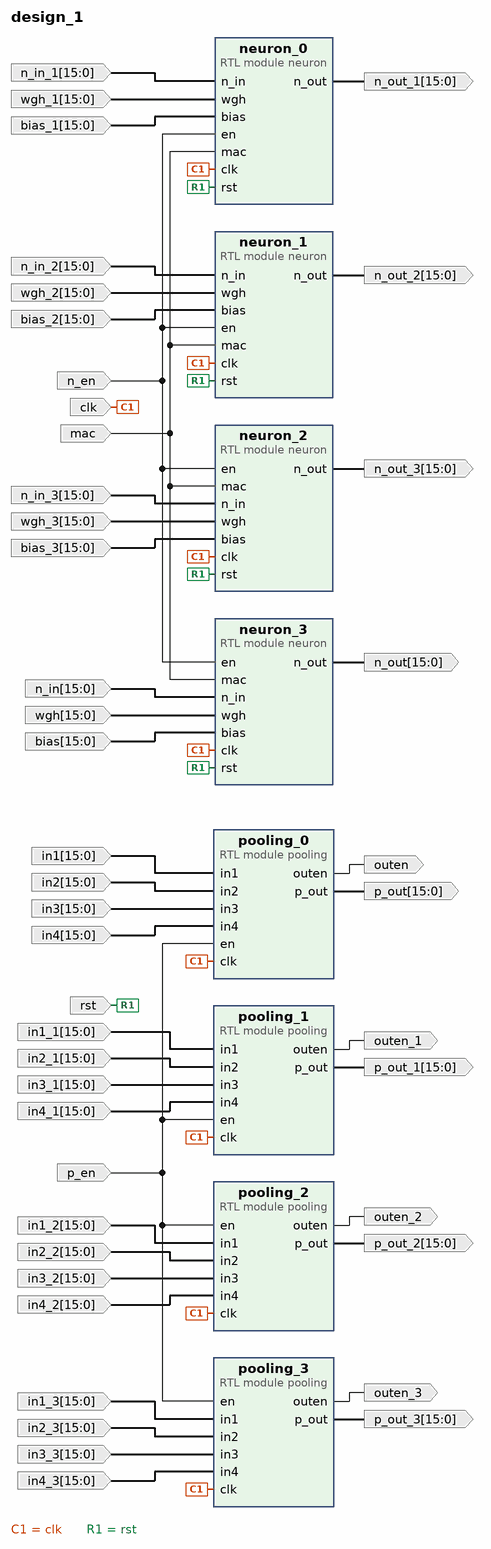
[diagram p0: block diagram of the top level]
# Vivado block design design_1, xc7k160tfbg484-3, Vivado 2016.3
create_bd_design design_1

create_bd_port -dir O -from 15 -to 0 n_out
create_bd_port -dir O -from 15 -to 0 n_out_1
create_bd_port -dir O -from 15 -to 0 n_out_2
create_bd_port -dir O -from 15 -to 0 n_out_3
create_bd_port -dir I -from 15 -to 0 n_in
create_bd_port -dir I -from 15 -to 0 n_in_1
create_bd_port -dir I -from 15 -to 0 n_in_2
create_bd_port -dir I -from 15 -to 0 n_in_3
create_bd_port -dir I -from 15 -to 0 wgh
create_bd_port -dir I -from 15 -to 0 bias
create_bd_port -dir I -from 15 -to 0 wgh_1
create_bd_port -dir I -from 15 -to 0 bias_1
create_bd_port -dir I -from 15 -to 0 wgh_2
create_bd_port -dir I -from 15 -to 0 bias_2
create_bd_port -dir I -from 15 -to 0 wgh_3
create_bd_port -dir I -from 15 -to 0 bias_3
create_bd_port -dir I -type clk clk
create_bd_port -dir I n_en
create_bd_port -dir I -type rst rst
create_bd_port -dir I mac
create_bd_port -dir I p_en
create_bd_port -dir I -from 15 -to 0 in1
create_bd_port -dir I -from 15 -to 0 in2
create_bd_port -dir I -from 15 -to 0 in3
create_bd_port -dir I -from 15 -to 0 in4
create_bd_port -dir I -from 15 -to 0 in1_1
create_bd_port -dir I -from 15 -to 0 in2_1
create_bd_port -dir I -from 15 -to 0 in3_1
create_bd_port -dir I -from 15 -to 0 in4_1
create_bd_port -dir I -from 15 -to 0 in1_2
create_bd_port -dir I -from 15 -to 0 in2_2
create_bd_port -dir I -from 15 -to 0 in3_2
create_bd_port -dir I -from 15 -to 0 in4_2
create_bd_port -dir I -from 15 -to 0 in1_3
create_bd_port -dir I -from 15 -to 0 in2_3
create_bd_port -dir I -from 15 -to 0 in3_3
create_bd_port -dir I -from 15 -to 0 in4_3
create_bd_port -dir O -from 15 -to 0 p_out
create_bd_port -dir O outen
create_bd_port -dir O -from 15 -to 0 p_out_1
create_bd_port -dir O outen_1
create_bd_port -dir O -from 15 -to 0 p_out_2
create_bd_port -dir O outen_2
create_bd_port -dir O -from 15 -to 0 p_out_3
create_bd_port -dir O outen_3

create_bd_cell -type module -reference neuron neuron_0
create_bd_cell -type module -reference pooling pooling_0
create_bd_cell -type module -reference neuron neuron_1
create_bd_cell -type module -reference neuron neuron_2
create_bd_cell -type module -reference neuron neuron_3
create_bd_cell -type module -reference pooling pooling_1
create_bd_cell -type module -reference pooling pooling_2
create_bd_cell -type module -reference pooling pooling_3

# ---- connections ----

connect_bd_net [get_bd_pins neuron_3/n_out] [get_bd_ports n_out]
connect_bd_net [get_bd_pins neuron_0/n_out] [get_bd_ports n_out_1]
connect_bd_net [get_bd_pins neuron_1/n_out] [get_bd_ports n_out_2]
connect_bd_net [get_bd_pins neuron_2/n_out] [get_bd_ports n_out_3]
connect_bd_net [get_bd_ports n_in] [get_bd_pins neuron_3/n_in]
connect_bd_net -net n_in_1_1 [get_bd_ports n_in_1] [get_bd_pins neuron_0/n_in]
connect_bd_net -net n_in_2_1 [get_bd_ports n_in_2] [get_bd_pins neuron_1/n_in]
connect_bd_net -net n_in_3_1 [get_bd_ports n_in_3] [get_bd_pins neuron_2/n_in]
connect_bd_net [get_bd_ports wgh] [get_bd_pins neuron_3/wgh]
connect_bd_net [get_bd_ports bias] [get_bd_pins neuron_3/bias]
connect_bd_net -net wgh_1_1 [get_bd_ports wgh_1] [get_bd_pins neuron_0/wgh]
connect_bd_net -net bias_1_1 [get_bd_ports bias_1] [get_bd_pins neuron_0/bias]
connect_bd_net -net wgh_2_1 [get_bd_ports wgh_2] [get_bd_pins neuron_1/wgh]
connect_bd_net -net bias_2_1 [get_bd_ports bias_2] [get_bd_pins neuron_1/bias]
connect_bd_net -net wgh_3_1 [get_bd_ports wgh_3] [get_bd_pins neuron_2/wgh]
connect_bd_net -net bias_3_1 [get_bd_ports bias_3] [get_bd_pins neuron_2/bias]
connect_bd_net [get_bd_ports clk] \
  [get_bd_pins neuron_0/clk] [get_bd_pins pooling_0/clk] [get_bd_pins neuron_1/clk] [get_bd_pins neuron_2/clk] \
  [get_bd_pins neuron_3/clk] [get_bd_pins pooling_1/clk] [get_bd_pins pooling_2/clk] [get_bd_pins pooling_3/clk]
connect_bd_net -net en_1 [get_bd_ports n_en] [get_bd_pins neuron_0/en] [get_bd_pins neuron_1/en] [get_bd_pins neuron_2/en] [get_bd_pins neuron_3/en]
connect_bd_net [get_bd_ports rst] [get_bd_pins neuron_0/rst] [get_bd_pins neuron_1/rst] [get_bd_pins neuron_2/rst] [get_bd_pins neuron_3/rst]
connect_bd_net [get_bd_ports mac] [get_bd_pins neuron_0/mac] [get_bd_pins neuron_1/mac] [get_bd_pins neuron_2/mac] [get_bd_pins neuron_3/mac]
connect_bd_net -net en_2 [get_bd_ports p_en] \
  [get_bd_pins pooling_0/en] [get_bd_pins pooling_1/en] [get_bd_pins pooling_2/en] [get_bd_pins pooling_3/en]
connect_bd_net -net in1_1 [get_bd_ports in1] [get_bd_pins pooling_0/in1]
connect_bd_net -net in2_1 [get_bd_ports in2] [get_bd_pins pooling_0/in2]
connect_bd_net -net in3_1 [get_bd_ports in3] [get_bd_pins pooling_0/in3]
connect_bd_net -net in4_1 [get_bd_ports in4] [get_bd_pins pooling_0/in4]
connect_bd_net -net in1_1_1 [get_bd_ports in1_1] [get_bd_pins pooling_1/in1]
connect_bd_net -net in2_1_1 [get_bd_ports in2_1] [get_bd_pins pooling_1/in2]
connect_bd_net -net in3_1_1 [get_bd_ports in3_1] [get_bd_pins pooling_1/in3]
connect_bd_net -net in4_1_1 [get_bd_ports in4_1] [get_bd_pins pooling_1/in4]
connect_bd_net -net in1_2_1 [get_bd_ports in1_2] [get_bd_pins pooling_2/in1]
connect_bd_net -net in2_2_1 [get_bd_ports in2_2] [get_bd_pins pooling_2/in2]
connect_bd_net -net in3_2_1 [get_bd_ports in3_2] [get_bd_pins pooling_2/in3]
connect_bd_net -net in4_2_1 [get_bd_ports in4_2] [get_bd_pins pooling_2/in4]
connect_bd_net -net in1_3_1 [get_bd_ports in1_3] [get_bd_pins pooling_3/in1]
connect_bd_net -net in2_3_1 [get_bd_ports in2_3] [get_bd_pins pooling_3/in2]
connect_bd_net -net in3_3_1 [get_bd_ports in3_3] [get_bd_pins pooling_3/in3]
connect_bd_net -net in4_3_1 [get_bd_ports in4_3] [get_bd_pins pooling_3/in4]
connect_bd_net [get_bd_pins pooling_0/p_out] [get_bd_ports p_out]
connect_bd_net [get_bd_pins pooling_0/outen] [get_bd_ports outen]
connect_bd_net [get_bd_pins pooling_1/p_out] [get_bd_ports p_out_1]
connect_bd_net [get_bd_pins pooling_1/outen] [get_bd_ports outen_1]
connect_bd_net [get_bd_pins pooling_2/p_out] [get_bd_ports p_out_2]
connect_bd_net [get_bd_pins pooling_2/outen] [get_bd_ports outen_2]
connect_bd_net [get_bd_pins pooling_3/p_out] [get_bd_ports p_out_3]
connect_bd_net [get_bd_pins pooling_3/outen] [get_bd_ports outen_3]

validate_bd_design
save_bd_design
